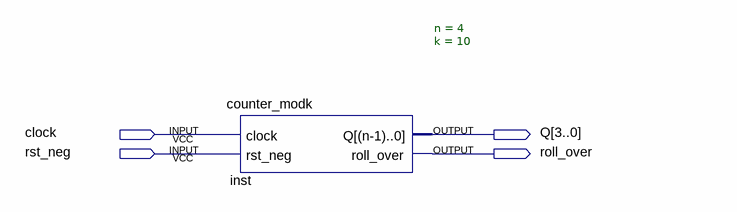
[diagram p0: schematic sheet]
// Quartus schematic roll_over_test.bdf as structural Verilog: 1 symbols, 4 pins
module roll_over_test (
  input  clock,
  input  rst_neg,
  output [3:0] Q,
  output roll_over
);

  counter_modk #(.n(4), .k(10)) inst (.clock(clock), .rst_neg(rst_neg), .Q(Q), .roll_over(roll_over));
endmodule
